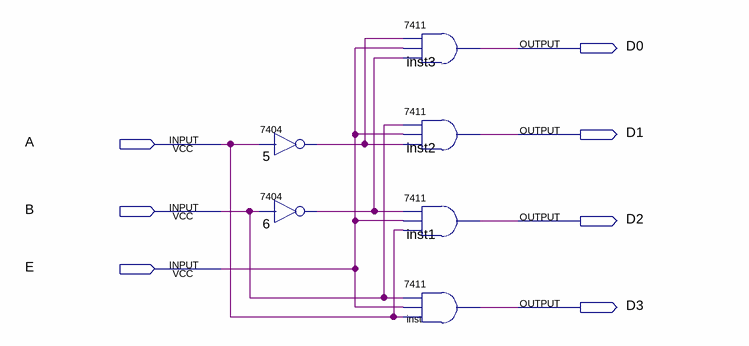
[diagram p0: schematic sheet]
// Quartus schematic 11.bdf as structural Verilog: 6 symbols, 7 pins
module \11  (
  input  A,
  input  B,
  input  E,
  output D0,
  output D1,
  output D2,
  output D3
);

  wire n5_1, n6_1;

  \7404  u_5 (.\2 (A), .\1 (n5_1));
  \7404  u_6 (.\2 (B), .\1 (n6_1));
  \7411  inst3 (.\2 (n5_1), .\3 (E), .\4 (n6_1), .\1 (D0));
  \7411  inst2 (.\2 (B), .\3 (E), .\4 (n5_1), .\1 (D1));
  \7411  inst1 (.\2 (n6_1), .\3 (E), .\4 (A), .\1 (D2));
  \7411  inst (.\2 (B), .\3 (E), .\4 (A), .\1 (D3));
endmodule
